# EAGLE schematic GeorgeTry1 (EAGLE 8.0.2)
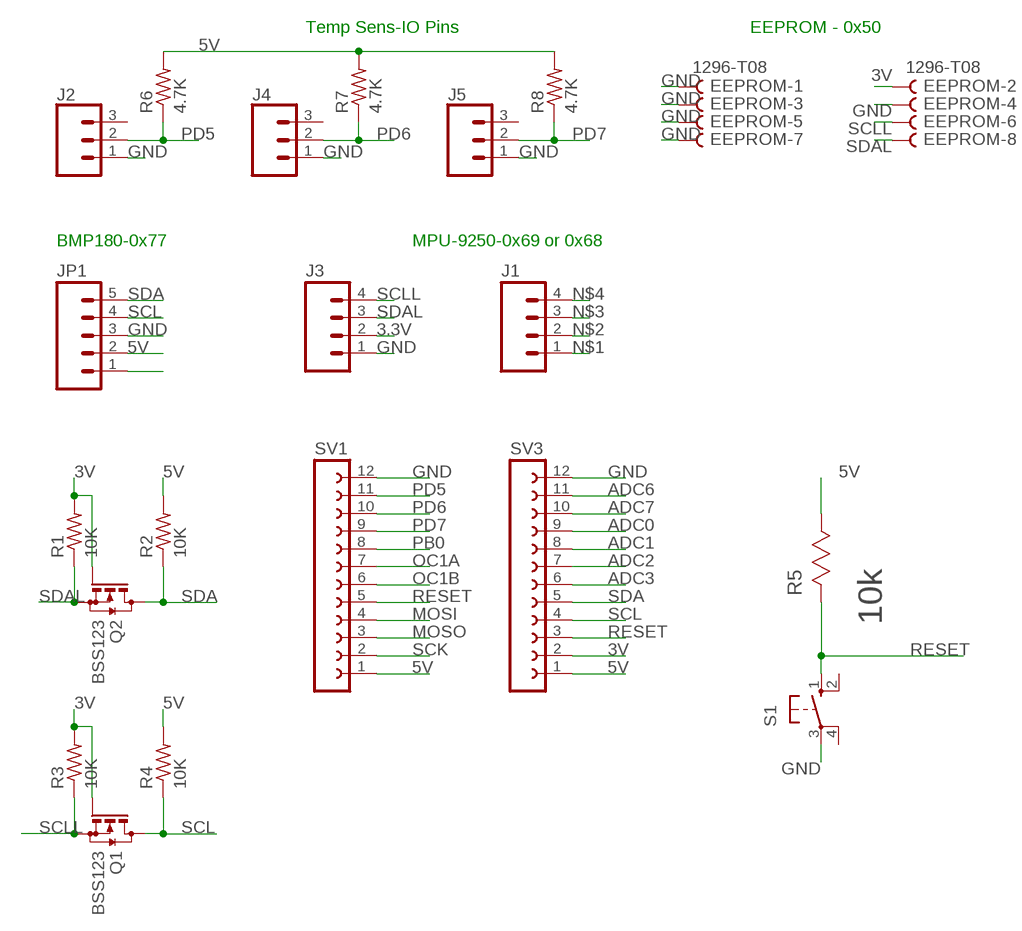
[diagram p0: schematic, sheet 1]

## Parts
EEPROM  1296-T08  [1296-08]
J1  M04PTH  [1X04]
J2  CONN_03  [1X03]
J3  M04PTH  [1X04]
J4  CONN_03  [1X03]
J5  CONN_03  [1X03]
JP1  M05SMD2  [1X05-1MM-RA]
Q1  BSS123  [SOT23]
Q2  BSS123  [SOT23]
R1  10K  R-US_M1406  [M1406]
R2  10K  R-US_M1406  [M1406]
R3  10K  R-US_M1406  [M1406]
R4  10K  R-US_M1406  [M1406]
R5  10k  CRCW08051M00JNEA  [RESC2013X65N]
R6  4.7K  R-US_M1406  [M1406]
R7  4.7K  R-US_M1406  [M1406]
R8  4.7K  R-US_M1406  [M1406]
S1  10-XX  [B3F-10XX]
SV1  FE12-1  [FE12]
SV3  FE12-1  [FE12]

## Nets
3.3V: J3.2
3V: EEPROM.2 Q1.1(G) Q2.1(G) R1.2 R3.2 SV3.2
5V: JP1.2 R2.2 R4.2 R5.1 R6.2 R7.2 R8.2 SV1.1 SV3.1
ADC0: SV3.9
ADC1: SV3.8
ADC2: SV3.7
ADC3: SV3.6
ADC6: SV3.11
ADC7: SV3.10
GND: EEPROM.1 EEPROM.3 EEPROM.4 EEPROM.5 EEPROM.7 J2.1 J3.1 J4.1 J5.1 JP1.3 S1.3(P) SV1.12 SV3.12
MOSI: SV1.4
MOSO: SV1.3
N$1: J1.1
N$2: J1.2
N$3: J1.3
N$4: J1.4
N$5: JP1.1
OC1A: SV1.7
OC1B: SV1.6
PB0: SV1.8
PD5: J2.2 R6.1 SV1.11
PD6: J4.2 R7.1 SV1.10
PD7: J5.2 R8.1 SV1.9
RESET: R5.2 S1.1(S) SV1.5 SV3.3
SCK: SV1.2
SCL: JP1.4 Q1.3(D) R4.1 SV3.4
SCLL: EEPROM.6 J3.4 Q1.2(S) R3.1
SDA: JP1.5 Q2.3(D) R2.1 SV3.5
SDAL: EEPROM.8 J3.3 Q2.2(S) R1.1
Unconnected: J2.3 J4.3 J5.3 S1.2(S1) S1.4(P1)

## Notes on the sheet
- Temp Sens-IO Pins | EEPROM - 0x50
- BMP180-0x77 | MPU-9250-0x69 or 0x68

## Library data of the parts
EEPROM = con-leotronics:1296-T08: 1.27mm SINGLE ROW FEMALE SOCKET Source: http://www.leotronics.co.uk/Conexcon/Data%20Sheets/sec.%20A/1296ing.pdf; OC_FARNELL: unknown; OC_NEWARK: unknown
J1 J3 = SparkFun-Connectors:M04: Header 4 Standard 4-pin 0.1" header. Use with straight break away headers (SKU : PRT-00116), right angle break away headers (PRT-00553), swiss pins (PRT-00743), machine pins (PRT-00117), and female headers (PRT-00115). Molex polarized connector foot print use with SKU : PRT-08231 with associated crimp pins and housings. 1MM SMD Version SKU: PRT-10208; PROD_ID: CONN-09696
J2 J4 J5 = SparkFun-Connectors:CONN_03: Multi connection point. Often used as Generic Header-pin footprint for 0.1 inch spaced/style header connections On any of the 0.1 inch spaced packages, you can populate with these: Break Away Headers - Straight <https://www.sparkfun.com/products/116> (PRT-00116) Break Away Male Headers - Right Angle <https://www.sparkfun.com/products/553> (PRT-00553) Female Headers <https://www.sparkfun.com/products/115> (PRT-00115) Break Away Headers - Machine Pin <https://www.sparkfun.com/products/117> (PRT-00117) Break Away Female Headers - Swiss Machine Pin <https://www.sparkfun.com/products/743> (PRT-00743) Stackable Header - 3 Pin (Female, 0.1") <https://www.sparkfun.com/products/13875> (PRT-13875) For SCREWTERMINALS and SPRING TERMINALS visit here: Screw Terimnals on SparkFun.com <https://www.sparkfun.com/search/results?term=Screw+Terminals> (5mm/3.5mm/2.54mm spacing) This device is also useful as a general connection point to wire up your design to another part of your project. Our various solder wires solder well into these plated through hole pads. Hook-Up Wire - Assortment (Stranded, 22 AWG) <https://www.sparkfun.com/products/11375> (PRT-11375) Hook-Up Wire - Assortment (Solid Core, 22 AWG) <https://www.sparkfun.com/products/11367> (PRT-11367) View the entire wire category on our website here <https://www.sparkfun.com/categories/141> Special notes: Molex polarized connector foot print use with SKU : PRT-08232 with associated crimp pins and housings.
JP1 = BMP180 breakout:M05: Header 5 Standard 5-pin 0.1" header. Use with straight break away headers (SKU : PRT-00116), right angle break away headers (PRT-00553), swiss pins (PRT-00743), machine pins (PRT-00117), and female headers (PRT-00115). Molex polarized connector foot print use with SKU : PRT-08230 with associated crimp pins and housings.
Q1 Q2 = transistor-small-signal:BSS123: N-CHANNEL MOS FET
R1-R4 R6-R8 = resistor:R-US_: RESISTOR, American symbol
R5 = Vishay_By_element14_Batch_1:CRCW08051M00JNEA: RESISTOR, 0805; MPN: CRCW08051M00JNEA; OC_FARNELL: 1514803; OC_NEWARK: 59M6845; SUPPLIER: Vishay; TOLERANCE: ± 5.0 %; VALUE: 1M Ohms; WATTAGE: 0.125W
S1 = switch-omron:10-XX: OMRON SWITCH; MPN: B3F-1000; OC_FARNELL: 176432; OC_NEWARK: 36M3542
SV1 SV3 = con-lsta:FE12-1: FEMALE HEADER; OC_FARNELL: unknown; OC_NEWARK: unknown